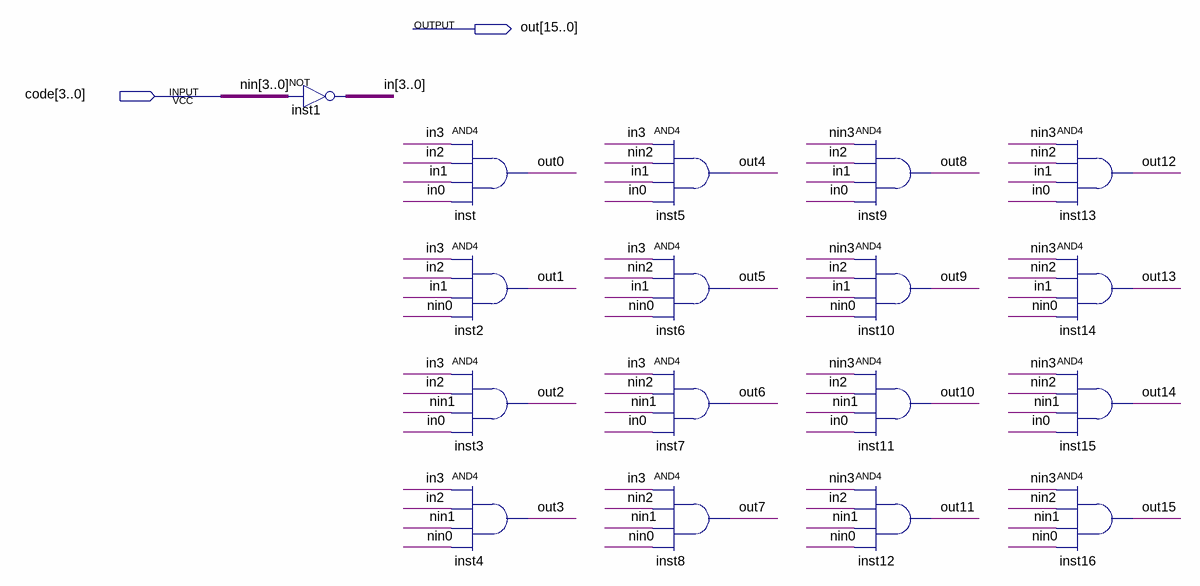
[diagram p0: schematic sheet]
// Quartus schematic DC4.bdf as structural Verilog: 17 symbols, 2 pins
module DC4 (
  input  [3:0] code,
  output [15:0] out
);

  wire [3:0] in;

  assign in = ~code;  // NOT inst1, 4 bits wide
  and inst (out[0], in[3], in[2], in[1], in[0]);
  and inst2 (out[1], in[3], in[2], in[1], code[0]);
  and inst3 (out[2], in[3], in[2], code[1], in[0]);
  and inst4 (out[3], in[3], in[2], code[1], code[0]);
  and inst5 (out[4], in[3], code[2], in[1], in[0]);
  and inst6 (out[5], in[3], code[2], in[1], code[0]);
  and inst7 (out[6], in[3], code[2], code[1], in[0]);
  and inst8 (out[7], in[3], code[2], code[1], code[0]);
  and inst9 (out[8], code[3], in[2], in[1], in[0]);
  and inst10 (out[9], code[3], in[2], in[1], code[0]);
  and inst11 (out[10], code[3], in[2], code[1], in[0]);
  and inst12 (out[11], code[3], in[2], code[1], code[0]);
  and inst13 (out[12], code[3], code[2], in[1], in[0]);
  and inst14 (out[13], code[3], code[2], in[1], code[0]);
  and inst15 (out[14], code[3], code[2], code[1], in[0]);
  and inst16 (out[15], code[3], code[2], code[1], code[0]);

  // Other names for the same wires on the sheet: nin[3:0] = code; nin0 = code[0]; nin1 = code[1]; nin2 = code[2];
  //   nin3 = code[3]
endmodule
